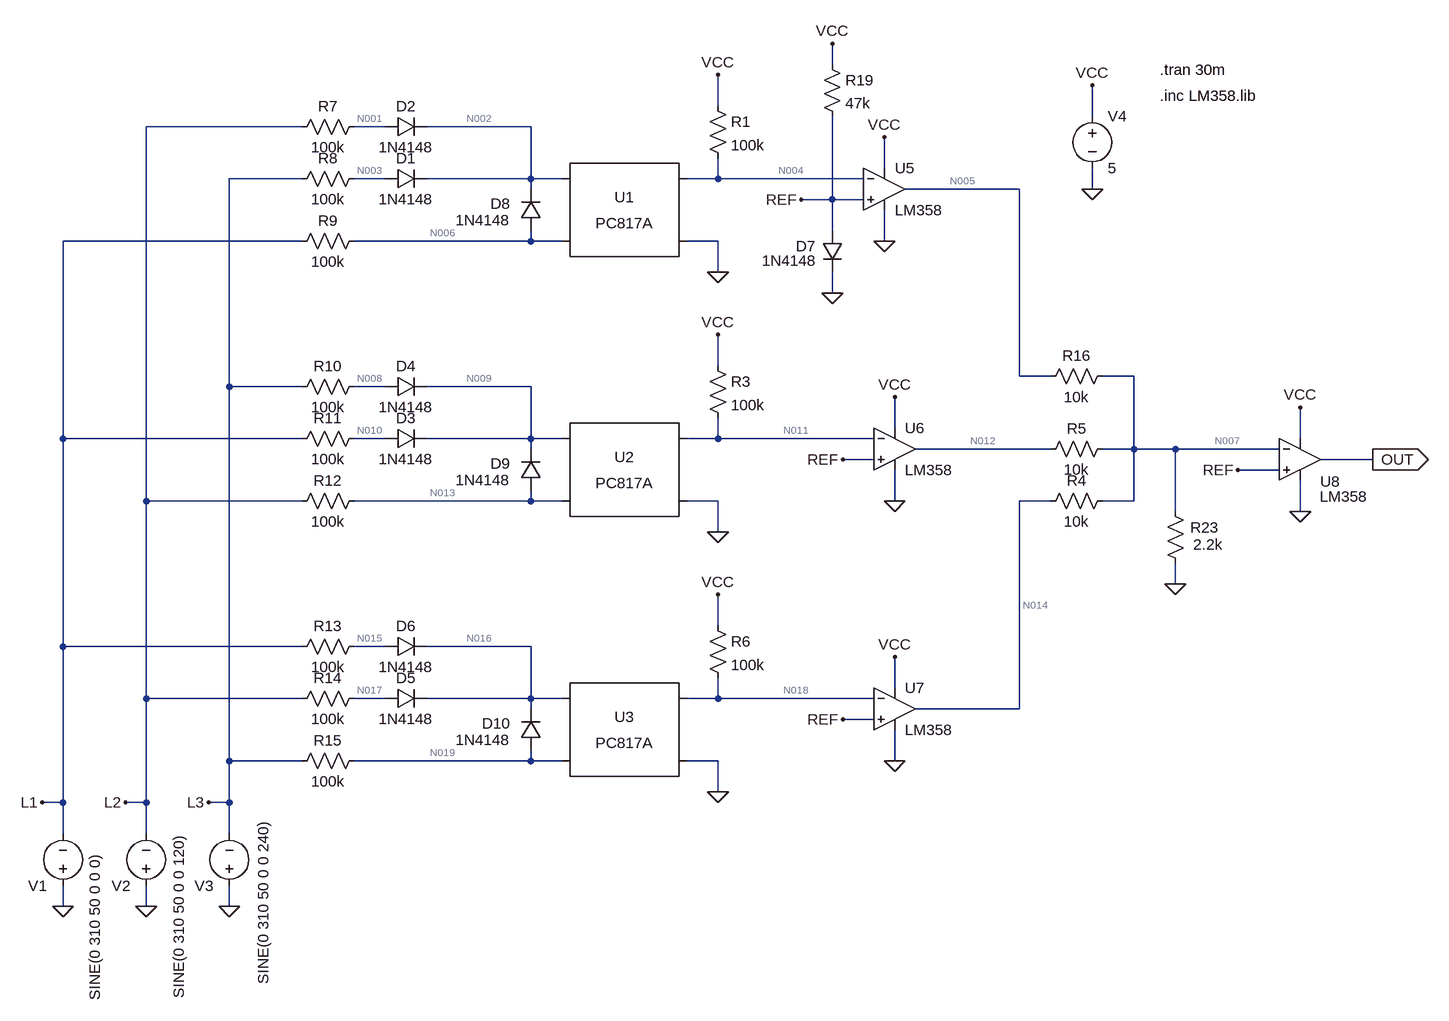
[diagram p0: schematic v1.0.asc]
v1.0.asc, the LTspice schematic file:
Version 4.1
SHEET 1 2556 1396
WIRE 928 -224 928 -256
WIRE 752 -160 752 -208
WIRE 1328 -144 1328 -192
WIRE 112 -128 -128 -128
WIRE 240 -128 192 -128
WIRE 464 -128 304 -128
WIRE 1008 -64 1008 -112
WIRE 112 -48 0 -48
WIRE 240 -48 192 -48
WIRE 464 -48 464 -128
WIRE 464 -48 304 -48
WIRE 512 -48 464 -48
WIRE 752 -48 752 -80
WIRE 752 -48 704 -48
WIRE 976 -48 752 -48
WIRE 464 -32 464 -48
WIRE 1216 -32 1040 -32
WIRE 1328 -32 1328 -64
WIRE 928 -16 928 -144
WIRE 928 -16 880 -16
WIRE 976 -16 928 -16
WIRE 928 32 928 -16
WIRE 112 48 -256 48
WIRE 464 48 464 32
WIRE 464 48 192 48
WIRE 512 48 464 48
WIRE 752 48 704 48
WIRE 1008 48 1008 0
WIRE 752 96 752 48
WIRE 928 128 928 96
WIRE 752 240 752 192
WIRE 1216 256 1216 -32
WIRE 1264 256 1216 256
WIRE 1392 256 1344 256
WIRE 0 272 0 -48
WIRE 112 272 0 272
WIRE 240 272 192 272
WIRE 464 272 304 272
WIRE 1024 336 1024 288
WIRE -256 352 -256 48
WIRE 112 352 -256 352
WIRE 240 352 192 352
WIRE 464 352 464 272
WIRE 464 352 304 352
WIRE 512 352 464 352
WIRE 752 352 752 320
WIRE 752 352 704 352
WIRE 992 352 752 352
WIRE 1648 352 1648 304
WIRE 464 368 464 352
WIRE 1264 368 1056 368
WIRE 1392 368 1392 256
WIRE 1392 368 1344 368
WIRE 1456 368 1392 368
WIRE 1616 368 1456 368
WIRE 992 384 944 384
WIRE 1760 384 1680 384
WIRE 1616 400 1552 400
WIRE -128 448 -128 -128
WIRE 112 448 -128 448
WIRE 464 448 464 432
WIRE 464 448 192 448
WIRE 512 448 464 448
WIRE 752 448 704 448
WIRE 1024 448 1024 400
WIRE 1264 448 1216 448
WIRE 1392 448 1392 368
WIRE 1392 448 1344 448
WIRE 1456 464 1456 368
WIRE 1648 464 1648 416
WIRE 752 496 752 448
WIRE 1456 576 1456 544
WIRE 752 640 752 592
WIRE -256 672 -256 352
WIRE 112 672 -256 672
WIRE 240 672 192 672
WIRE 464 672 304 672
WIRE 1024 736 1024 688
WIRE -128 752 -128 448
WIRE 112 752 -128 752
WIRE 240 752 192 752
WIRE 464 752 464 672
WIRE 464 752 304 752
WIRE 512 752 464 752
WIRE 752 752 752 720
WIRE 752 752 704 752
WIRE 992 752 752 752
WIRE 464 768 464 752
WIRE 1216 768 1216 448
WIRE 1216 768 1056 768
WIRE 992 784 944 784
WIRE 0 848 0 272
WIRE 112 848 0 848
WIRE 464 848 464 832
WIRE 464 848 192 848
WIRE 512 848 464 848
WIRE 752 848 704 848
WIRE 1024 848 1024 800
WIRE 752 896 752 848
WIRE -256 912 -256 672
WIRE -256 912 -288 912
WIRE -128 912 -128 752
WIRE -128 912 -160 912
WIRE 0 912 0 848
WIRE 0 912 -32 912
WIRE -256 960 -256 912
WIRE -128 960 -128 912
WIRE 0 960 0 912
WIRE -256 1072 -256 1040
WIRE -128 1072 -128 1040
WIRE 0 1072 0 1040
FLAG -256 1072 0
FLAG -128 1072 0
FLAG 0 1072 0
FLAG 752 96 0
FLAG 1328 -32 0
FLAG 1328 -192 VCC
FLAG 752 -208 VCC
FLAG -288 912 L1
FLAG -160 912 L2
FLAG -32 912 L3
FLAG 752 496 0
FLAG 752 192 VCC
FLAG 752 896 0
FLAG 752 592 VCC
FLAG 1008 -112 VCC
FLAG 1008 48 0
FLAG 1024 288 VCC
FLAG 1024 448 0
FLAG 1024 688 VCC
FLAG 1024 848 0
FLAG 1760 384 OUT
IOPIN 1760 384 Out
FLAG 928 128 0
FLAG 928 -256 VCC
FLAG 1648 304 VCC
FLAG 1648 464 0
FLAG 1456 576 0
FLAG 880 -16 REF
FLAG 944 384 REF
FLAG 944 784 REF
FLAG 1552 400 REF
SYMBOL voltage -256 1056 R180
WINDOW 3 -49 -161 VRight 2
WINDOW 123 0 0 Left 0
WINDOW 39 0 0 Left 0
SYMATTR Value SINE(0 310 50 0 0 0)
SYMATTR InstName V1
SYMBOL voltage -128 1056 R180
WINDOW 3 -50 -158 VRight 2
WINDOW 123 0 0 Left 0
WINDOW 39 0 0 Left 0
SYMATTR Value SINE(0 310 50 0 0 120)
SYMATTR InstName V2
SYMBOL voltage 0 1056 R180
WINDOW 3 -52 -136 VRight 2
WINDOW 123 0 0 Left 0
WINDOW 39 0 0 Left 0
SYMATTR Value SINE(0 310 50 0 0 240)
SYMATTR InstName V3
SYMBOL Optos\\PC817A 608 0 R0
SYMATTR InstName U1
SYMBOL res 736 -176 R0
SYMATTR InstName R1
SYMATTR Value 100k
SYMBOL voltage 1328 -160 R0
WINDOW 123 0 0 Left 0
WINDOW 39 0 0 Left 0
SYMATTR InstName V4
SYMATTR Value 5
SYMBOL diode 240 -32 R270
WINDOW 0 32 32 VTop 2
WINDOW 3 0 32 VBottom 2
SYMATTR InstName D1
SYMATTR Value 1N4148
SYMBOL diode 240 -112 R270
WINDOW 0 32 32 VTop 2
WINDOW 3 0 32 VBottom 2
SYMATTR InstName D2
SYMATTR Value 1N4148
SYMBOL Optos\\PC817A 608 400 R0
SYMATTR InstName U2
SYMBOL res 736 224 R0
SYMATTR InstName R3
SYMATTR Value 100k
SYMBOL diode 240 368 R270
WINDOW 0 32 32 VTop 2
WINDOW 3 0 32 VBottom 2
SYMATTR InstName D3
SYMATTR Value 1N4148
SYMBOL diode 240 288 R270
WINDOW 0 32 32 VTop 2
WINDOW 3 0 32 VBottom 2
SYMATTR InstName D4
SYMATTR Value 1N4148
SYMBOL Optos\\PC817A 608 800 R0
SYMATTR InstName U3
SYMBOL res 736 624 R0
SYMATTR InstName R6
SYMATTR Value 100k
SYMBOL diode 240 768 R270
WINDOW 0 32 32 VTop 2
WINDOW 3 0 32 VBottom 2
SYMATTR InstName D5
SYMATTR Value 1N4148
SYMBOL diode 240 688 R270
WINDOW 0 32 32 VTop 2
WINDOW 3 0 32 VBottom 2
SYMATTR InstName D6
SYMATTR Value 1N4148
SYMBOL res 208 -144 R90
WINDOW 0 0 56 VBottom 2
WINDOW 3 32 56 VTop 2
SYMATTR InstName R7
SYMATTR Value 100k
SYMBOL res 208 -64 R90
WINDOW 0 0 56 VBottom 2
WINDOW 3 32 56 VTop 2
SYMATTR InstName R8
SYMATTR Value 100k
SYMBOL res 208 32 R90
WINDOW 0 0 56 VBottom 2
WINDOW 3 32 56 VTop 2
SYMATTR InstName R9
SYMATTR Value 100k
SYMBOL res 208 256 R90
WINDOW 0 0 56 VBottom 2
WINDOW 3 32 56 VTop 2
SYMATTR InstName R10
SYMATTR Value 100k
SYMBOL res 208 336 R90
WINDOW 0 0 56 VBottom 2
WINDOW 3 32 56 VTop 2
SYMATTR InstName R11
SYMATTR Value 100k
SYMBOL res 208 432 R90
WINDOW 0 0 56 VBottom 2
WINDOW 3 32 56 VTop 2
SYMATTR InstName R12
SYMATTR Value 100k
SYMBOL res 208 656 R90
WINDOW 0 0 56 VBottom 2
WINDOW 3 32 56 VTop 2
SYMATTR InstName R13
SYMATTR Value 100k
SYMBOL res 208 736 R90
WINDOW 0 0 56 VBottom 2
WINDOW 3 32 56 VTop 2
SYMATTR InstName R14
SYMATTR Value 100k
SYMBOL res 208 832 R90
WINDOW 0 0 56 VBottom 2
WINDOW 3 32 56 VTop 2
SYMATTR InstName R15
SYMATTR Value 100k
SYMBOL res 1360 432 R90
WINDOW 0 0 56 VBottom 2
WINDOW 3 32 56 VTop 2
SYMATTR InstName R4
SYMATTR Value 10k
SYMBOL res 1360 352 R90
WINDOW 0 0 56 VBottom 2
WINDOW 3 32 56 VTop 2
SYMATTR InstName R5
SYMATTR Value 10k
SYMBOL res 1360 240 R90
WINDOW 0 0 56 VBottom 2
WINDOW 3 32 56 VTop 2
SYMATTR InstName R16
SYMATTR Value 10k
SYMBOL Extra\\LM358 1008 -96 R0
SYMATTR InstName U5
SYMBOL Extra\\LM358 1024 304 R0
SYMATTR InstName U6
SYMBOL Extra\\LM358 1024 704 R0
SYMATTR InstName U7
SYMBOL diode 912 32 R0
WINDOW 0 -40 24 Left 2
WINDOW 3 -92 46 Left 2
SYMATTR InstName D7
SYMATTR Value 1N4148
SYMBOL res 912 -240 R0
SYMATTR InstName R19
SYMATTR Value 47k
SYMBOL Extra\\LM358 1648 320 R0
WINDOW 0 31 98 Left 2
WINDOW 3 30 121 Left 2
SYMATTR InstName U8
SYMBOL res 1472 560 R180
WINDOW 0 -51 71 Left 2
WINDOW 3 -57 45 Left 2
SYMATTR InstName R23
SYMATTR Value 2.2k
SYMBOL diode 480 32 R180
WINDOW 0 47 42 Left 2
WINDOW 3 47 16 Left 2
SYMATTR InstName D8
SYMATTR Value 1N4148
SYMBOL diode 480 432 R180
WINDOW 0 47 42 Left 2
WINDOW 3 47 16 Left 2
SYMATTR InstName D9
SYMATTR Value 1N4148
SYMBOL diode 480 832 R180
WINDOW 0 47 42 Left 2
WINDOW 3 47 16 Left 2
SYMATTR InstName D10
SYMATTR Value 1N4148
TEXT 1432 -216 Left 2 !.tran 30m
TEXT 1432 -176 Left 2 !.inc LM358.lib

The netlist it stands for:
* v1.0.asc
V1 0 L1 SINE(0 310 50 0 0 0)
V2 0 L2 SINE(0 310 50 0 0 120)
V3 0 L3 SINE(0 310 50 0 0 240)
X§U1 N002 N006 N004 0 PC817 Igain=1m
R1 VCC N004 100k
V4 VCC 0 5
D1 N003 N002 1N4148
D2 N001 N002 1N4148
X§U2 N009 N013 N011 0 PC817 Igain=1m
R3 VCC N011 100k
D3 N010 N009 1N4148
D4 N008 N009 1N4148
X§U3 N016 N019 N018 0 PC817 Igain=1m
R6 VCC N018 100k
D5 N017 N016 1N4148
D6 N015 N016 1N4148
R7 N001 L2 100k
R8 N003 L3 100k
R9 N006 L1 100k
R10 N008 L3 100k
R11 N010 L1 100k
R12 N013 L2 100k
R13 N015 L1 100k
R14 N017 L2 100k
R15 N019 L3 100k
R4 N007 N014 10k
R5 N007 N012 10k
R16 N007 N005 10k
* U5: LM358 (symbol Extra\LM358 not available, pins judged from their places): In+=REF In-=N004 V+=VCC V-=0 OUT=N005
* U6: LM358 (symbol Extra\LM358 not available, pins judged from their places): In+=REF In-=N011 V+=VCC V-=0 OUT=N012
* U7: LM358 (symbol Extra\LM358 not available, pins judged from their places): In+=REF In-=N018 V+=VCC V-=0 OUT=N014
D7 REF 0 1N4148
R19 VCC REF 47k
* U8: LM358 (symbol Extra\LM358 not available, pins judged from their places): In+=REF In-=N007 V+=VCC V-=0 OUT=OUT
R23 0 N007 2.2k
D8 N006 N002 1N4148
D9 N013 N009 1N4148
D10 N019 N016 1N4148
.model D D
.lib standard.dio
.tran 30m
.inc LM358.lib
.lib PC817.sub
.backanno
.end

* Results of the author's LTspice run, read from the files saved beside the schematic
* Operating Point, zero values left out:
*   V(l2) = -268.5 V
*   V(l3) = 268.5 V
*   V(n001) = -268.5 V
*   V(n002) = 134.4 V
*   V(n003) = 135 V
*   V(n004) = 79.09 mV
*   V(n005) = 21.64 mV
*   V(n006) = 133.4 V
*   V(n007) = 472.7 mV
*   V(n008) = 836.7 mV
*   V(n009) = 206.4 mV
*   V(n010) = 249.4 µV
*   V(n011) = 61.29 mV
*   V(n012) = 21.64 mV
*   V(n013) = -836.9 mV
*   V(n014) = 3.523 V
*   V(n015) = 278.8 µV
*   V(n016) = 268.4 V
*   V(n017) = -268.5 V
*   V(n018) = 5 V
*   V(n019) = 268.5 V
*   V(out) = 85.07 mV
*   V(ref) = 478.1 mV
*   V(vcc) = 5 V
*   I(D1) = 1.334 mA
*   I(D10) = 5.845 nA
*   I(D2) = -2.923 nA
*   I(D3) = -2.494 nA
*   I(D4) = 2.676 mA
*   I(D5) = -3.057 nA
*   I(D6) = -2.788 nA
*   I(D7) = 96.24 µA
*   I(D8) = -2.521 nA
*   I(D9) = -2.521 nA
*   I(R1) = 49.21 µA
*   I(R10) = -2.676 mA
*   I(R11) = 2.494 nA
*   I(R12) = 2.676 mA
*   I(R13) = 2.788 nA
*   I(R14) = 3.057 nA
*   I(R15) = -5.845 nA
*   I(R16) = 45.1 µA
*   I(R19) = 96.21 µA
*   I(R23) = -214.9 µA
*   I(R3) = 49.39 µA
*   I(R4) = -305 µA
*   I(R5) = 45.1 µA
*   I(R6) = 15.59 pA
*   I(R7) = 2.923 nA
*   I(R8) = -1.334 mA
*   I(R9) = 1.334 mA
*   I(V1) = -1.334 mA
*   I(V2) = -2.676 mA
*   I(V3) = 4.011 mA
*   I(V4) = 2.04 mA